# Altium project SetoDiff.PrjPcb
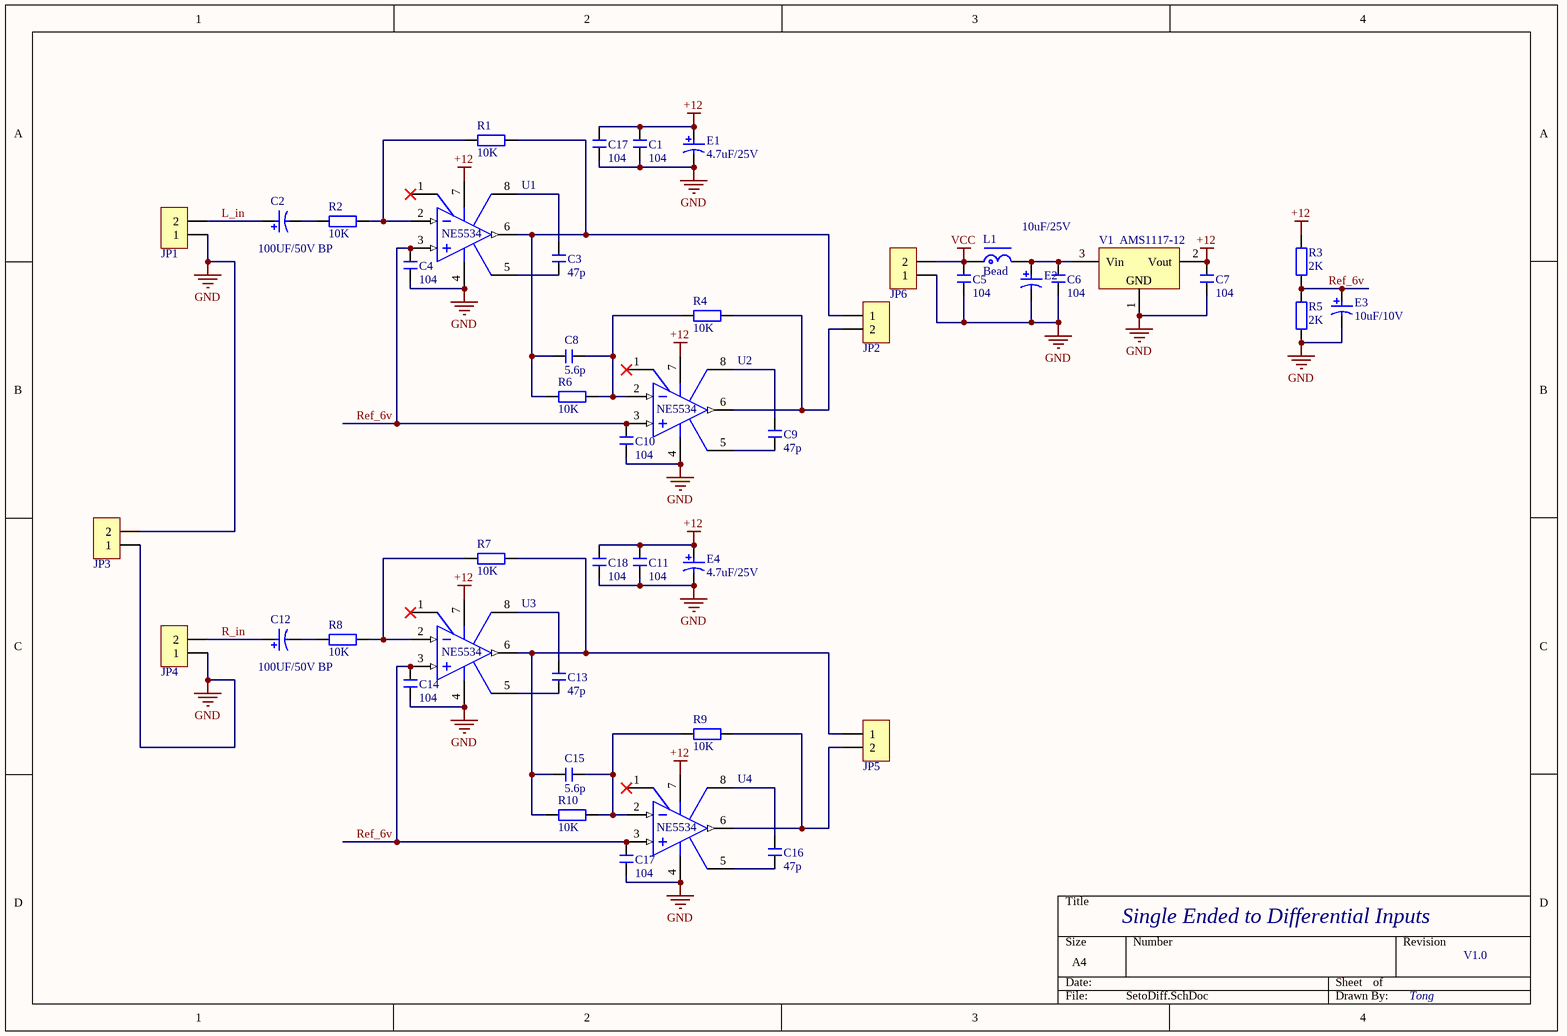
[diagram p0: SetoDiff.SchDoc]
1 sheet, 45 parts. Net scope: global (net labels, ports and power ports of the same name join across sheets).
Board file: SetoDiff.PcbDoc

## Sheet SetoDiff.SchDoc
size A4

### Parts
(Parts that share a designator on the sheet are numbered #1, #2 ... from top to bottom, then left to right.)
C1  104  [C 0603]
C2  100UF/50V BP  [CAP 5.0*10*12.5]
C3  47p  [C 0603]
C4  104  [C 0603]
C5  104  [C 0805]
C6  104  [C 0805]
C7  104  [C 0805]
C8  5.6p  [C 0603]
C9  47p  [C 0603]
C10  104  [C 0603]
C11  104  [C 0603]
C12  100UF/50V BP  [CAP 5.0*10*12.5]
C13  47p  [C 0603]
C14  104  [C 0603]
C15  5.6p  [C 0603]
C16  47p  [C 0603]
C17#1  104  [C 0603]
C17#2  104  [C 0603]
C18  104  [C 0603]
E1  4.7uF/25V  [CD A(3216)]
E2  10uF/25V  [CD B(3528)]
E3  10uF/10V  [CD B(3528)]
E4  4.7uF/25V  [CD A(3216)]
JP1  HDR-1X2  [HDR-1X2]  (value not drawn)
JP2  HDR-1X2  [HDR-1X2]  (value not drawn)
JP3  HDR-1X2  [HDR-1X2]  (value not drawn)
JP4  HDR-1X2  [HDR-1X2]  (value not drawn)
JP5  HDR-1X2  [HDR-1X2]  (value not drawn)
JP6  HDR-1X2  [HDR-1X2]  (value not drawn)
L1  Bead  [L 0805]
R1  10K  [Res-SMD-0603]
R2  10K  [Res-SMD-0603]
R3  2K  [Res-SMD-0805]
R4  10K  [Res-SMD-0603]
R5  2K  [Res-SMD-0805]
R6  10K  [Res-SMD-0603]
R7  10K  [Res-SMD-0603]
R8  10K  [Res-SMD-0603]
R9  10K  [Res-SMD-0603]
R10  10K  [Res-SMD-0603]
U1  NE5534  [SOP8_N]
U2  NE5534  [SOP8_N]
U3  NE5534  [SOP8_N]
U4  NE5534  [SOP8_N]
V1  AMS1117-12  [SOT223_L]

### Nets
+12: C1.1 C7.1 C11.1 C17#1.1 C18.1 E1.A E4.A R3.2 U1.7 U2.7 U3.7 U4.7 V1.2(Vout)
GND: C1.2 C4.2 C5.2 C6.2 C7.2 C10.2 C11.2 C14.2 C17#1.2 C17#2.2 C18.2 E1.K E2.K E3.K E4.K JP1.1 JP3.1 JP3.2 JP4.1 JP6.1 R5.1 U1.4(V-) U2.4(V-) U3.4(V-) U4.4(V-) V1.1(GND)
VCC: C5.1 JP6.2 L1.1
L_in: C2.A JP1.2
R_in: C12.A JP4.2
Ref_6v: C4.1 C10.1 C14.1 C17#2.1 E3.A R3.1 R5.2 U1.3(IN+) U2.3(IN+) U3.3(IN+) U4.3(IN+)
NetC2_K: C2.K R2.1
NetC3_1: C3.1 U1.8
NetC3_2: C3.2 U1.5(NC)
NetC6_1: C6.1 E2.A L1.2 V1.3(Vin)
NetC8_1: C8.1 JP2.1 R1.2 R6.1 U1.6(OS_NUL)
NetC8_2: C8.2 R4.1 R6.2 U2.2(IN-)
NetC9_1: C9.1 U2.8
NetC9_2: C9.2 U2.5(NC)
NetC12_K: C12.K R8.1
NetC13_1: C13.1 U3.8
NetC13_2: C13.2 U3.5(NC)
NetC15_1: C15.1 JP5.1 R7.2 R10.1 U3.6(OS_NUL)
NetC15_2: C15.2 R9.1 R10.2 U4.2(IN-)
NetC16_1: C16.1 U4.8
NetC16_2: C16.2 U4.5(NC)
NetJP2_2: JP2.2 R4.2 U2.6(OS_NUL)
NetJP5_2: JP5.2 R9.2 U4.6(OS_NUL)
NetR1_1: R1.1 R2.2 U1.2(IN-)
NetR7_1: R7.1 R8.2 U3.2(IN-)

Not connected (* = marked no-connect by the designer): U1 1*; U2 1*; U3 1*; U4 1*

### Notes on the sheet
- Single Ended to Differential Inputs
- V1.0
- Tong

### Library data of the parts
C1 C3-C11 C13-C16 C17#1 C17#2 C18 = Cap-CER-SMD: 瓷片电容-贴片
C2 C12 = Cap-AE-RAD: 铝电解电容-直插
E1-E4 = Cap-TAN-SMD: 钽电解电容-贴片
JP1-JP6 = Header 2: 2P接插件; 版权归属: 源创客; BOM名称: 2P接插件; 学习资源: www.ooocke.com
L1 = Ind-Beads-SMD: 贴片电感-小功率
R1-R10 = Res-Fixed-SMD: 固定电阻器-贴片
U1-U4 = NE5534: 双电源高精度运放; 版权归属: 源创客; BOM名称: 双电源高精度运放; 学习资源: www.ooocke.com
V1 = AMS1117: 三端稳压芯片; BOM名称: 稳压芯片; 版权归属: 源创客; 学习资源: www.ooocke.com